# EAGLE design DSO150_Conversion_Board_2_1 (EAGLE 9.2.1)
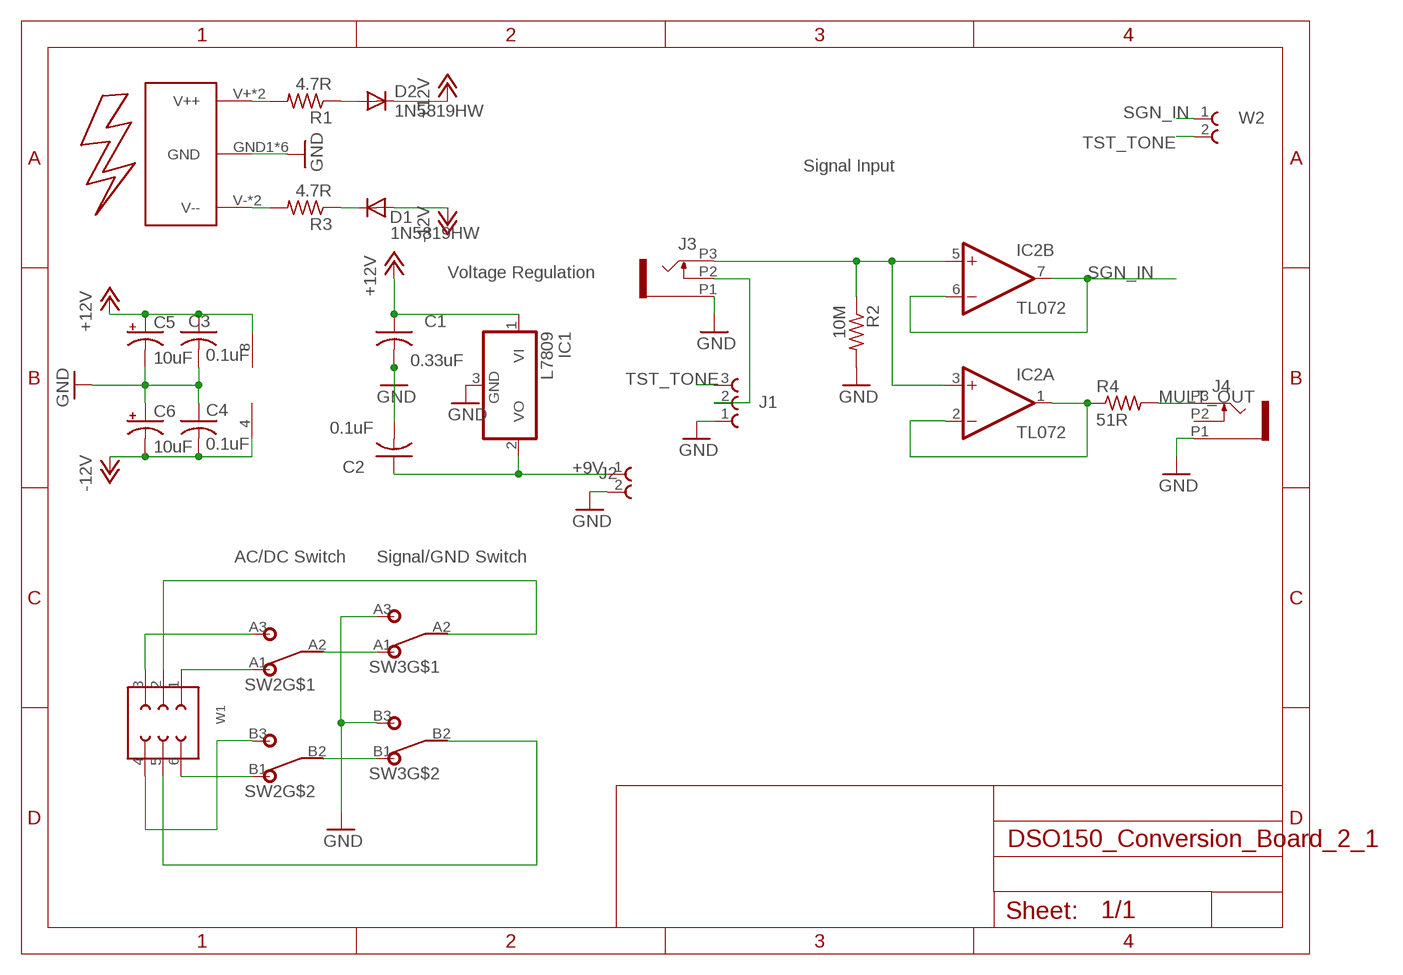
[diagram p0: schematic, sheet 1]

## Parts
C1  0.33uF  C-USC0805  [C0805]
C2  0.1uF  C-USC0805  [C0805]
C3  0.1uF  C-USC0805  [C0805]
C4  0.1uF  C-USC0805  [C0805]
C5  10uF  CPOL-USB  [PANASONIC_B]
C6  10uF  CPOL-USB  [PANASONIC_B]
D1  1N5819HW  DIODE_DIODE-SOD123  [DIODE_SOD123]
D2  1N5819HW  DIODE_DIODE-SOD123  [DIODE_SOD123]
IC1  L7809  7808DT  [TO252]
IC2  TL072  TL072D  [SO08]
J1  61300311121  [61300311121]
J2  61300211121  [61300211121]
J3  OG-PJ301_PJ301_THONKICONN7  [OG-PJ301_WQP_PJ_301M7]
J4  OG-PJ301_PJ301_THONKICONN7  [OG-PJ301_WQP_PJ_301M7]
R1  4.7R  R-US_R1206  [R1206]
R2  10M  R-US_R0805  [R0805]
R3  4.7R  R-US_R1206  [R1206]
R4  51R  R-US_R0805  [R0805]
SW2  SUBDPDT  [SUBMINIDPDT]
SW3  SUBDPDT  [SUBMINIDPDT]
U$2  EURO_POWER2  [EURO_POWER2]
W1  61300621121  [61300621121]
W2  61300211121  [61300211121]

## Nets
+9V: C2.1 IC1.2(VO) J2.1
+12V: C1.1 C3.1 C5.+ D2.C IC1.1(VI) IC2.8(P:V+)
-12V: C4.2 C6.- D1.A IC2.4(P:V-)
GND: C1.2 C2.2 C3.2 C4.1 C5.- C6.+ IC1.3(GND) J1.1 J2.2 J3.P1 J4.P1 R2.2 SW3.A3 SW3.B3 U$2.GND1(GND) U$2.GND2(GND) U$2.GND3(GND) U$2.GND4(GND) U$2.GND5(GND) U$2.GND6(GND)
MULT_OUT: IC2.1(A:OUT) IC2.2(A:-IN) R4.1
N$1: J1.2 J3.P2
N$2: R3.2 U$2.V-(V--) U$2.V--
N$3: D1.C R3.1
N$4: R1.2 U$2.V+(V++) U$2.V++
N$5: IC2.3(A:+IN) IC2.5(B:+IN) J3.P3 R2.1
N$6: SW2.A1 W1.1
N$7: SW2.B1 W1.6
N$8: SW2.B2 SW3.B1
N$9: SW2.A2 SW3.A1
N$10: J4.P3 R4.2
N$11: SW2.A3 W1.3
N$12: SW2.B3 W1.4
N$13: SW3.A2 W1.2
N$14: SW3.B2 W1.5
N$15: D2.A R1.1
SGN_IN: IC2.6(B:-IN) IC2.7(B:OUT) W2.1
TST_TONE: J1.3 W2.2
Unconnected: J4.P2

## Notes on the sheet
- Signal Input
- Voltage Regulation
- AC/DC Switch | Signal/GND Switch

## Library data of the parts
C1-C4 = rcl:C-US: CAPACITOR, American symbol; SPICEPREFIX: C
C5 C6 = rcl:CPOL-US: POLARIZED CAPACITOR, American symbol; SPICEPREFIX: C
D1 D2 = elements_v02:DIODE_DIODE-: DIODE
IC1 = linear:78*: Positive VOLTAGE REGULATOR Source: http://cache.national.com/ds/LM/LM78L05.pdf http://www.fairchildsemi.com/ds/LM/LM7805.pdf
IC2 = linear:TL072: OP AMP
J1 = Wurth_Elektronik_Electromechanic_Board_to_Board_Connectors_rev17a:61300311121: WR-PHD 5.54mm Pin Header, 3 Pin =>Code : Con_BTB_PHD_2.54_1_THT_61300311121 <http://katalog.we-online.de/media/images/eican/Con_BTB_PHD_2.54_1_THT_6130xx11121_pf2.jpg> Details see: http://katalog.we-online.de/en/em/613_0xx_111_21 Created 2014-05-29, Karrer Zheng 2014 (C) Würth Elektronik
J2 W2 = Wurth_Elektronik_Electromechanic_Board_to_Board_Connectors_rev17a:61300211121: WR-PHD 2.54mm Pin Header, 2 Pin=>Code : Con_BTB_PHD_2.54_1_THT_61300211121 <http://katalog.we-online.de/media/images/eican/Con_BTB_PHD_2.54_1_THT_6130xx11121_pf2.jpg> Details see: http://katalog.we-online.de/en/em/613_0xx_111_21 Created 2014-05-29, Karrer Zheng 2014 (C) Würth Elektronik
J3 J4 = elements_v02:OG-PJ301_PJ301_THONKICONN
R1-R4 = rcl:R-US_: RESISTOR, American symbol; SPICEPREFIX: R
SW2 SW3 = Sub-Miniature-switch:SUBDPDT
U$2 = INSTRUO:EURO_POWER2
W1 = Wurth_Elektronik_Electromechanic_Board_to_Board_Connectors_rev17a:61300621121: WR-PHD 2.54mm Dual Pin Header, 6 Pins =>Code : Con_BTB_PHD_2.54_2_61300621121 <http://katalog.we-online.de/media/images/eican/Con_BTB_PHD_2.54_2_6130xx21121_pf2.jpg> Details see: http://katalog.we-online.de/en/em/613_0xx_211_21 Created 2014-05-29, Karrer Zheng 2014 (C) Würth Elektronik

## Board
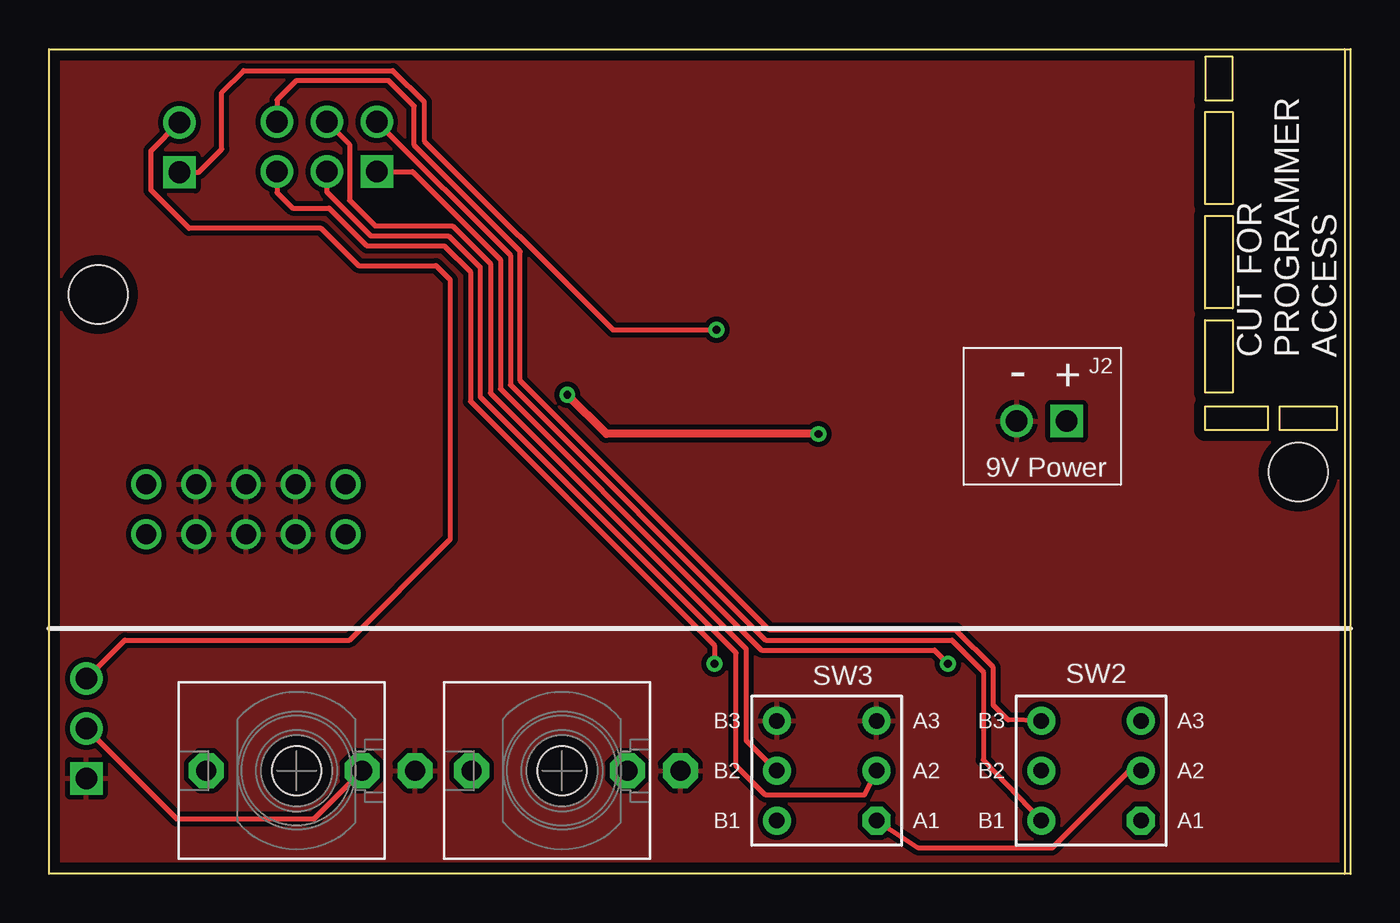
[diagram p1: board, top side]
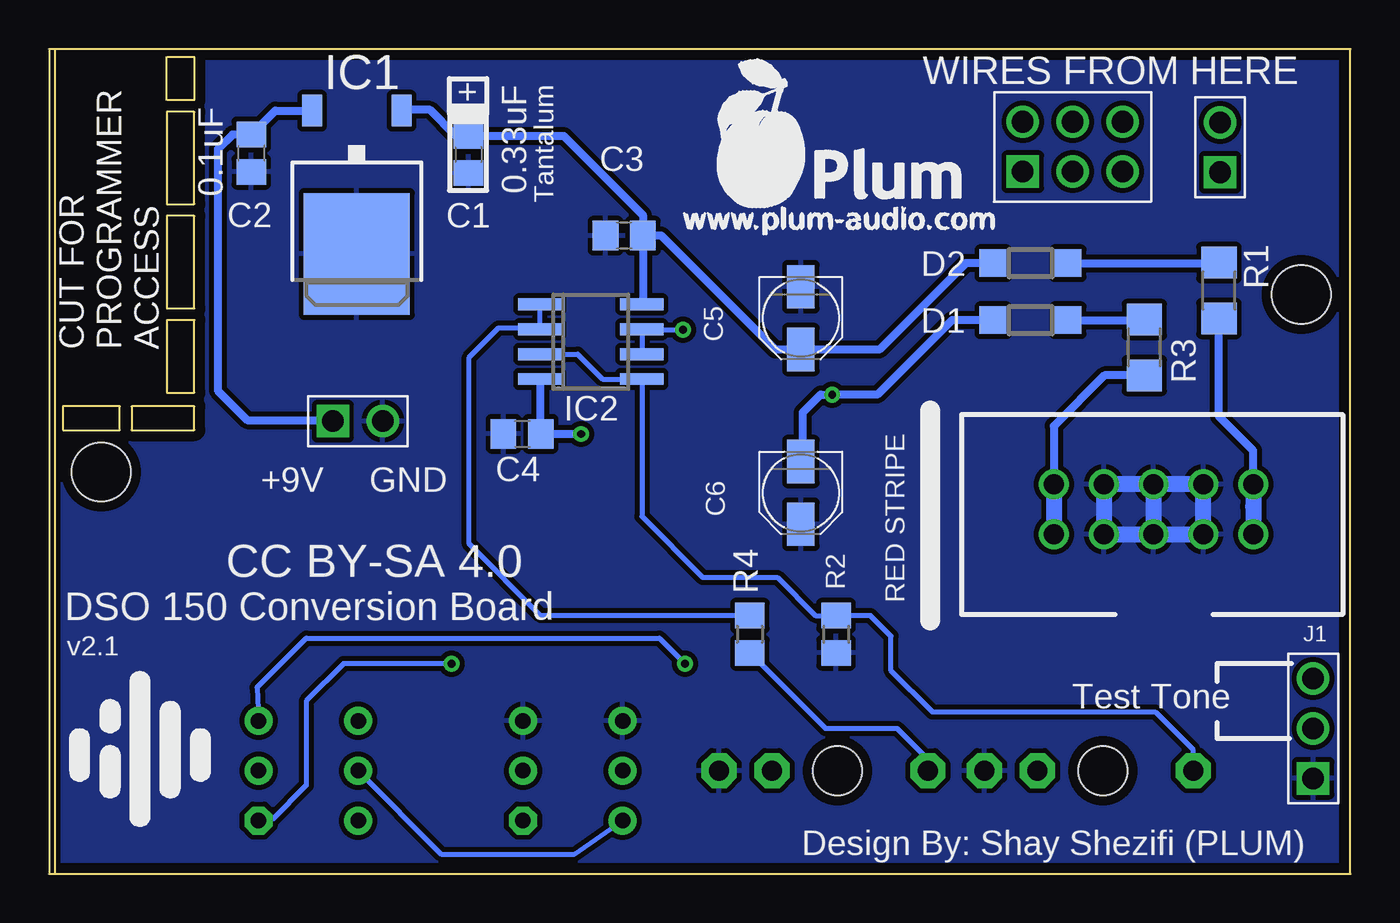
[diagram p2: board, bottom side, seen from below]

Size 66.3 x 42 mm. Coordinates in mm from the lower left corner, seen from the top.
Outline: 0,0 0,42 66.3,42 66.3,0 0,0
Outline: 65.6,22.6 62.7,22.6 62.7,23.8 65.6,23.8 65.6,22.6
Outline: 62.1,22.6 58.9,22.6 58.9,23.8 62.1,23.8 62.1,22.6
Outline: 58.9,24.5 58.9,28.2 60.3,28.2 60.3,24.5 58.9,24.5
Outline: 58.9,28.8 58.9,33.5 60.3,33.5 60.3,28.8 58.9,28.8
Outline: 58.9,34.1 58.9,38.8 60.3,38.8 60.3,34.1 58.9,34.1
Outline: 58.9,39.4 60.3,39.4 60.3,41.6 58.9,41.6 58.9,39.4
Copper layers (1*16): Top 0.035mm / dielectric 1.5mm / Bottom 0.035mm
Design rules "default *": minimum track width 10mil, minimum drill 0.4mm, track to track 10mil, track to pad 6mil, pad to pad 6mil, via to via 6mil, smd to smd 6mil, copper to edge 20mil, drill to drill 6mil, minimum pad ring 10mil, minimum via ring 8mil, stop-mask expansion 4mil, vias tented up to drill 25mil, thermal gap 10mil
Holes 3 mm at 2.5,29.5 63.64,20.46
Milling: 1 lines

### Footprints (pad centres in the part's own frame; a part is rotated, then mirrored left to right if it is on the bottom)
C0805 = smd 1.3 x 1.5: 1 -0.95,0; 2 0.95,0
PANASONIC_B = smd 2.2 x 1.4: + 1.6,0; - -1.6,0
DIODE_SOD123 = smd 1.4 x 1.4: A 1.9,0; C -1.9,0
TO252 = smd 1 x 1.6: 1 -2.28,-4.8; 2 2.28,-4.8 | smd 5.4 x 6.2: 3 0,2.5
SO08 = smd 0.6 x 2.2: 1 -1.905,-2.6; 2 -0.635,-2.6; 3 0.635,-2.6; 4 1.905,-2.6; 5 1.905,2.6; 6 0.635,2.6; 7 -0.635,2.6; 8 -1.905,2.6
61300311121 = drill 1.1 square: 1 -2.54,0 | drill 1.1: 2 0,0; 3 2.54,0
61300211121 = drill 1.1 square: 1 -1.27,0 | drill 1.1: 2 1.27,0
OG-PJ301_WQP_PJ_301M7 = drill 1.016 pad 1.778 octagon: P1 0,-6.032; P2 0,-3.334; P3 0,4.604 | hole 2.5: 0,0
R1206 = smd 1.6 x 1.803: 1 -1.422,0; 2 1.422,0
R0805 = smd 1.3 x 1.5: 1 -0.95,0; 2 0.95,0
SUBMINIDPDT = drill 0.787 pad 1.422 octagon: A1 -2.54,2.54 | drill 0.787 pad 1.422: A2 -2.54,0; A3 -2.54,-2.54; B1 2.54,2.54; B2 2.54,0; B3 2.54,-2.54
EURO_POWER2 = drill 1.016: GND1 -1.27,2.54; GND2 1.27,2.54; GND3 -1.27,0; GND4 1.27,0; GND5 -1.27,-2.54; GND6 1.27,-2.54; V+ -1.27,5.08; V++ 1.27,5.08; V- -1.27,-5.08; V-- 1.27,-5.08
61300621121 = drill 1.1 square: 1 -2.54,-1.27 | drill 1.1: 2 0,-1.27; 3 2.54,-1.27; 4 2.54,1.27; 5 0,1.27; 6 -2.54,1.27

### Placement (x,y rotation side)
C1  44.93,36.63 270 bottom
C2  56,36.7 270 bottom
C3  37,32.5 180 bottom
C4  42.2,22.4 0 bottom
C5  28,28.3 270 bottom
C6  28,19.4 270 bottom
D1  16.3,28.2 180 bottom
D2  16.3,31.1 0 bottom
IC1  50.62,34.07 180 bottom
IC2  38.7,27.1 270 bottom
J1  1.9,7.4 90 bottom
J2  50.57,23.05 0 bottom
J3  12.61,5.25 90 top
J4  26.13,5.25 90 top
R1  6.7,29.7 270 bottom
R2  26.2,12.2 270 bottom
R3  10.5,26.8 270 bottom
R4  30.6,12.2 270 bottom
SW2  53.09,5.25 180 top
SW3  39.62,5.25 180 top
U$2  10.03,18.56 270 bottom
W1  14.15,37.03 0 bottom
W2  6.64,37 90 bottom

### Tracks (layer width: path | path; a pad name or v marks a point on that pad's centre or on a via)
+9V
  Bottom 0.406: IC1.2 54.78,38.87 C2.1 56.95,37.65 57.7,36.9 57.7,24.6 56.2,23.1 51.89,23.1 J2.1
+12V
  Bottom 0.406: IC1.1 48.31,38.9 46.9,38.9 45.58,37.58 C1.1 40.08,37.58 36.05,33.55 C3.1 | C3.1 36.05,29.05 IC2.8 | C3.1 35.1,32.5 29.3,26.7 C5.+ 24,26.7 19.6,31.1 D2.C
-12V  (via drill 0.4)
  Top 0.406: v39.2,22.4 28.4,22.4 v26.4,24.4
  Bottom 0.254: C6.- 27.9,20.9
  Bottom 0.406: IC2.4 41.25,25.14 C4.2 v39.2,22.4 | 27.9,20.9 27.9,23.5 27,24.4 v26.4,24.4 24.1,24.4 20.3,28.2 D1.A
GND
  Bottom 0.813: U$2.GND4 U$2.GND6 U$2.GND5 U$2.GND3 | U$2.GND4 U$2.GND2 U$2.GND1 U$2.GND3 | U$2.GND3 U$2.GND4
  pour Bottom: 0.1,42 66.3,42 66.3,0.2 0,0.2
  pour Top: 0.1,42 66.3,42 66.3,0.2 0,0.2
MULT_OUT
  Bottom 0.254: IC2.1 41.3,27.8 | 41.3,27.8 IC2.2 | 41.3,27.8 43.4,27.8 44.9,26.3 44.9,16.8 41.25,13.15 R4.1
N$1
  Top 0.254: J1.2 6.5,2.8 13.49,2.8 J3.P2
N$2
  Bottom 0.406: U$2.V- 15.11,22.8 12.53,25.38 R3.2
  Bottom 0.813: U$2.V- U$2.V--
N$3
  Bottom 0.406: D1.C 10.52,28.2 R3.1
N$4
  Bottom 0.406: 5.08,17.16 U$2.V++ | U$2.V+ 4.95,21.55 6.7,23.3 R1.2
  Bottom 0.813: U$2.V+ 4.95,18.7 U$2.V++
N$5
  Bottom 0.254: J3.P3 8.01,6.31 9.94,8.25 21.3,8.25 23.4,10.35 23.4,12.1 24.45,13.15 R2.1 27.25,13.15 29.2,15.1 33,15.1 36.1,18.2 IC2.5 38.09,25.2 39.37,26.46 IC2.3
N$6  (via drill 0.4)
  Top 0.254: W1.1 18.51,35.76 22.99,31.28 22.99,24.69 33.39,14.29 36.29,11.39 45.11,11.39 v45.8,10.7
  Bottom 0.254: v45.8,10.7 51.3,10.7 53.2,8.8 53.2,4.5 54.94,2.76 SW2.A1
N$7
  Top 0.254: W1.6 23.5,31.49 23.5,24.9 36.5,11.9 46,11.9 47.6,10.3 47.6,5.78 SW2.B1
N$8
  Bottom 0.254: SW2.B2 46.32,1 39.52,1 SW3.B1
N$9
  Top 0.254: SW2.A2 55.1,5.3 51.1,1.3 44.3,1.3 SW3.A1
N$10
  Bottom 0.254: R4.2 26.75,7.4 23.1,7.4 21.53,5.83 J4.P3
N$11  (via drill 0.4)
  Top 0.254: v33.9,10.7 33.9,11.63 21.47,24.06 21.47,30.65 20.13,31.98 16.18,31.98 14.26,33.9 12.4,33.9 11.61,34.69 W1.3
  Bottom 0.254: SW2.A3 55.7,9.5 53.2,12 35.2,12 v33.9,10.7
N$12
  Top 0.254: SW2.B3 48.86,7.84 48.11,8.59 48.11,10.51 46.21,12.41 36.71,12.41 24.01,25.11 24.01,31.7 18.6,37.11 18.6,39.1 17.3,40.4 12.6,40.4 11.61,39.41 W1.4
N$13
  Top 0.254: SW3.A2 41.54,4 36.5,4 35,5.5 35,11.24 21.98,24.27 21.98,30.86 20.34,32.49 16.39,32.49 14.15,34.73 W1.2
N$14
  Top 0.254: W1.5 15.3,37.15 15.3,34.3 16.6,33 20.55,33 22.48,31.07 22.48,24.48 35.51,11.46 35.51,6.8 37.06,5.25 SW3.B2
N$15
  Bottom 0.406: D2.A 6.72,31.1 R1.1
SGN_IN  (via drill 0.4)
  Top 0.254: W2.1 7.63,35.73 8.8,36.9 8.8,39.8 9.91,40.91 17.51,40.91 19.11,39.31 19.11,37.32 28.73,27.7 v34,27.7
  Bottom 0.254: IC2.6 IC2.7 36.06,27.7 v34,27.7
TST_TONE
  Top 0.254: W2.2 5.2,36.83 5.2,34.8 7.14,32.86 13.86,32.86 15.76,30.97 19.71,30.97 20.45,30.23 20.45,23.5 20.45,17.05 15.3,11.9 3.86,11.9 J1.3

### Text on the board
tPlace: CUT FOR / PROGRAMMER / ACCESS | - | + | 9V Power | SW3 | SW2
bPlace: WIRES FROM HERE | Tantalum | + | CUT FOR / PROGRAMMER / ACCESS | GND | +9V | CC BY-SA 4.0 | RED STRIPE | DSO 150 Conversion Board | Test Tone | Design By: Shay Shezifi (PLUM)
bNames: v2.1